# Altium schematic sheet [09]SERIAL_PORT.SchDoc
size B
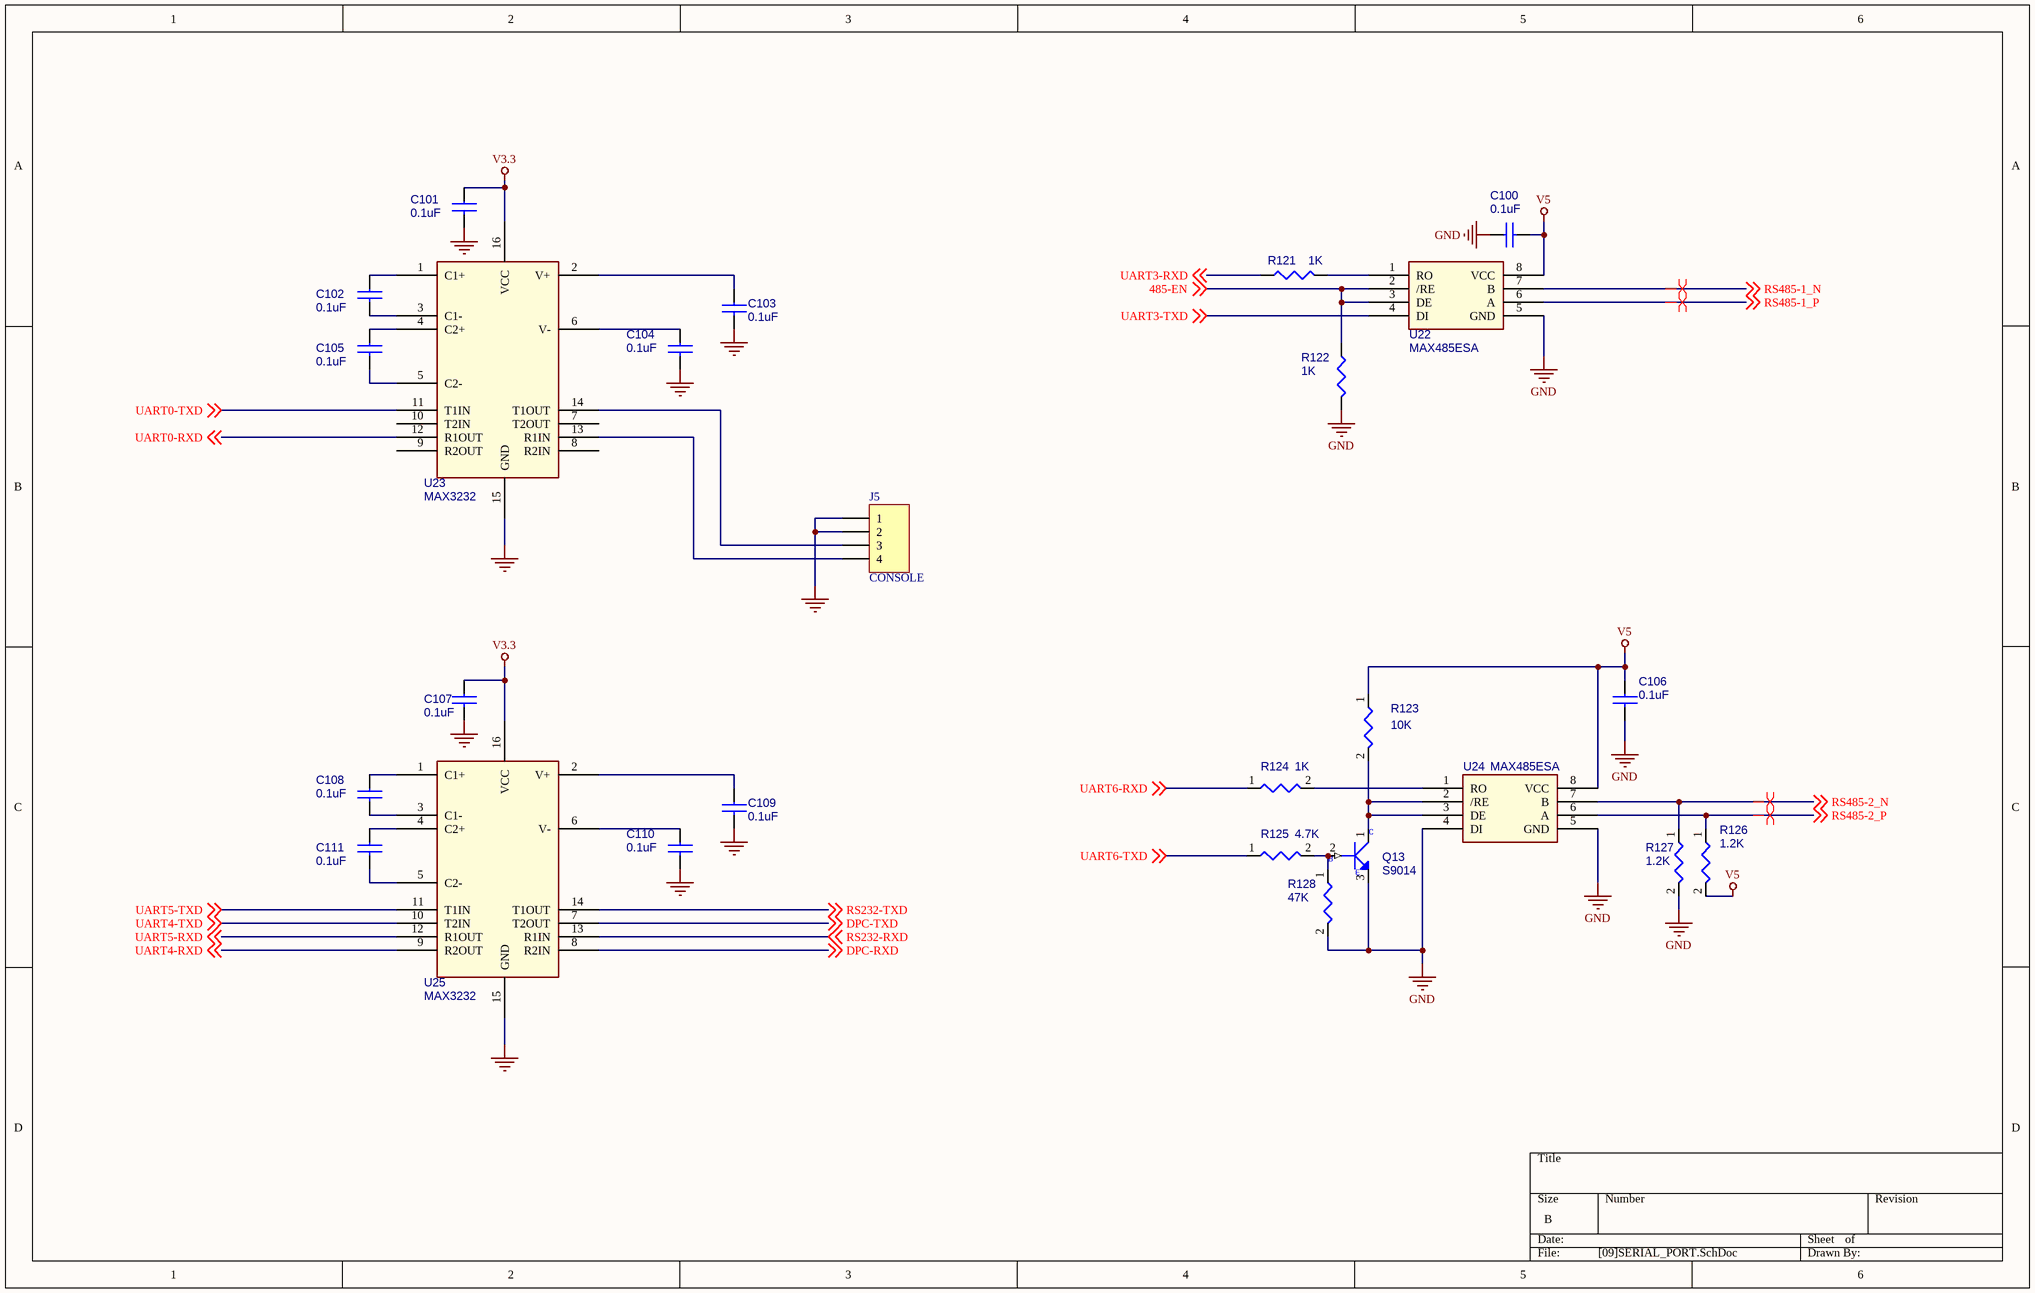
[diagram p0: [09]SERIAL_PORT.SchDoc]

## Parts
C100  0.1uF  [0603]
C101  0.1uF  [0603]
C102  0.1uF  [0603]
C103  0.1uF  [0603]
C104  0.1uF  [0603]
C105  0.1uF  [0603]
C106  0.1uF  [0603]
C107  0.1uF  [0603]
C108  0.1uF  [0603]
C109  0.1uF  [0603]
C110  0.1uF  [0603]
C111  0.1uF  [0603]
J5  CONSOLE  [HDR2X2H]
Q13  S9014  [NPN]
R121  1K  [0603]
R122  1K  [0603]
R123  10K  [0603]
R124  1K  [0603]
R125  4.7K  [0603]
R126  1.2K  [0603]
R127  1.2K  [0603]
R128  47K  [0603]
U22  MAX485ESA  [SO8]
U23  MAX3232  [SO-16]
U24  MAX485ESA  [SO8]
U25  MAX3232  [SO-16]

## Nets
GND: C100.1 C101.2 C103.2 C104.2 C106.2 C107.2 C109.2 C110.2 J5.1 J5.2 Q13.3(EMITTER) R122.2 R127.2 R128.2 U22.5(GND) U23.15(GND) U24.4(DI) U24.5(GND) U25.15(GND)
V3.3: C101.1 C107.1 U23.16(VCC) U25.16(VCC)
V5: C100.2 C106.1 R123.1 R126.2 U22.8(VCC) U24.8(VCC)
485-EN: R122.1 U22.2(/RE) U22.3(DE) ; off-sheet 485-EN
DPC-RXD: U25.8(R2IN) ; off-sheet DPC-RXD
DPC-TXD: U25.7(T2OUT) ; off-sheet DPC-TXD
RS232-RXD: U25.13(R1IN) ; off-sheet RS232-RXD
RS232-TXD: U25.14(T1OUT) ; off-sheet RS232-TXD
RS485-1_N: U22.7(B) ; off-sheet RS485-1_N
RS485-1_P: U22.6(A) ; off-sheet RS485-1_P
RS485-2_N: R127.1 U24.7(B) ; off-sheet RS485-2_N
RS485-2_P: R126.1 U24.6(A) ; off-sheet RS485-2_P
UART0-RXD: U23.12(R1OUT) ; off-sheet UART0-RXD
UART0-TXD: U23.11(T1IN) ; off-sheet UART0-TXD
UART3-RXD: R121.1 ; off-sheet UART3-RXD
UART3-TXD: U22.4(DI) ; off-sheet UART3-TXD
UART4-RXD: U25.9(R2OUT) ; off-sheet UART4-RXD
UART4-TXD: U25.10(T2IN) ; off-sheet UART4-TXD
UART5-RXD: U25.12(R1OUT) ; off-sheet UART5-RXD
UART5-TXD: U25.11(T1IN) ; off-sheet UART5-TXD
UART6-RXD: R124.1 ; off-sheet UART6-RXD
UART6-TXD: R125.1 ; off-sheet UART6-TXD
NetC102_1: C102.1 U23.1(C1+)
NetC102_2: C102.2 U23.3(C1-)
NetC103_1: C103.1 U23.2(V+)
NetC104_1: C104.1 U23.6(V-)
NetC105_1: C105.1 U23.4(C2+)
NetC105_2: C105.2 U23.5(C2-)
NetC108_1: C108.1 U25.1(C1+)
NetC108_2: C108.2 U25.3(C1-)
NetC109_1: C109.1 U25.2(V+)
NetC110_1: C110.1 U25.6(V-)
NetC111_1: C111.1 U25.4(C2+)
NetC111_2: C111.2 U25.5(C2-)
NetJ5_3: J5.3 U23.14(T1OUT)
NetJ5_4: J5.4 U23.13(R1IN)
NetQ13_1: Q13.1(COLLECTOR) R123.2 U24.2(/RE) U24.3(DE)
NetQ13_2: Q13.2(BASE) R125.2 R128.1
NetR121_2: R121.2 U22.1(RO)
NetR124_2: R124.2 U24.1(RO)

Not connected (* = marked no-connect by the designer): U23 7(T2OUT) 8(R2IN) 9(R2OUT) 10(T2IN)

## Layout directives
differential pair: RS485-1_N, RS485-1_P, RS485-2_N, RS485-2_P

## Notes on the sheet
- (in symbol MMBT3904_NL_SOT23-3) C; B; E

## Library data of the parts
C100 = P_CAP NP: Part Number: SE132225K8L; Part Description: S CER CAP 2.2U 10V K X5R 0603; Function Field: 41.5; Ecology: YES; ROOM: GPS; AP: AP; Part Type: CAPACITOR; Approved Date: 6/27/2006; Lead Free: MY
C101-C111 = CAP
J5 = Header 4: Header, 4-Pin
Q13 = MMBT3904_NL_SOT23-3: Part Description: S TR MMBT3904_NL NPN SOT23; Part Number: SB039040000
R121-R124 R126 R127 = R: Manufacturer Part number: null; Part Description: S RES 1/16W 10K +-5% 0402; Part Number: SD02810028L; ROOM: SD; Deletion Flag: 0; Function Field: 32.3; Ecology: YES; Part Type: RESISTOR; AP Sheet: http://ISPDPRD/Windchill/servlet/WindchillAuthGW/wt.enterprise.URLProcessor/URLTemplateAction?u8&oid=VR%3Aext.compal.part.Comp; AP: AP; Lead Free: Y1
R125 R128 = R: Part Number: SD02810028L; Part Description: S RES 1/16W 10K +-5% 0402; Manufacturer Part number: null; Ecology: YES; Function Field: 32.3; Deletion Flag: 0; ROOM: SD; Lead Free: Y1; AP: AP; AP Sheet: http://ISPDPRD/Windchill/servlet/WindchillAuthGW/wt.enterprise.URLProcessor/URLTemplateAction?u8&oid=VR%3Aext.compal.part.Comp; Part Type: RESISTOR
U22 U24 = MAX485